# Altium schematic sheet ADC.SchDoc: ThunderScope 1000E
size A4; DrawnBy: Aleksa Bjelogrlic; Revision: 1; SheetNumber: 5; SheetTotal: 14
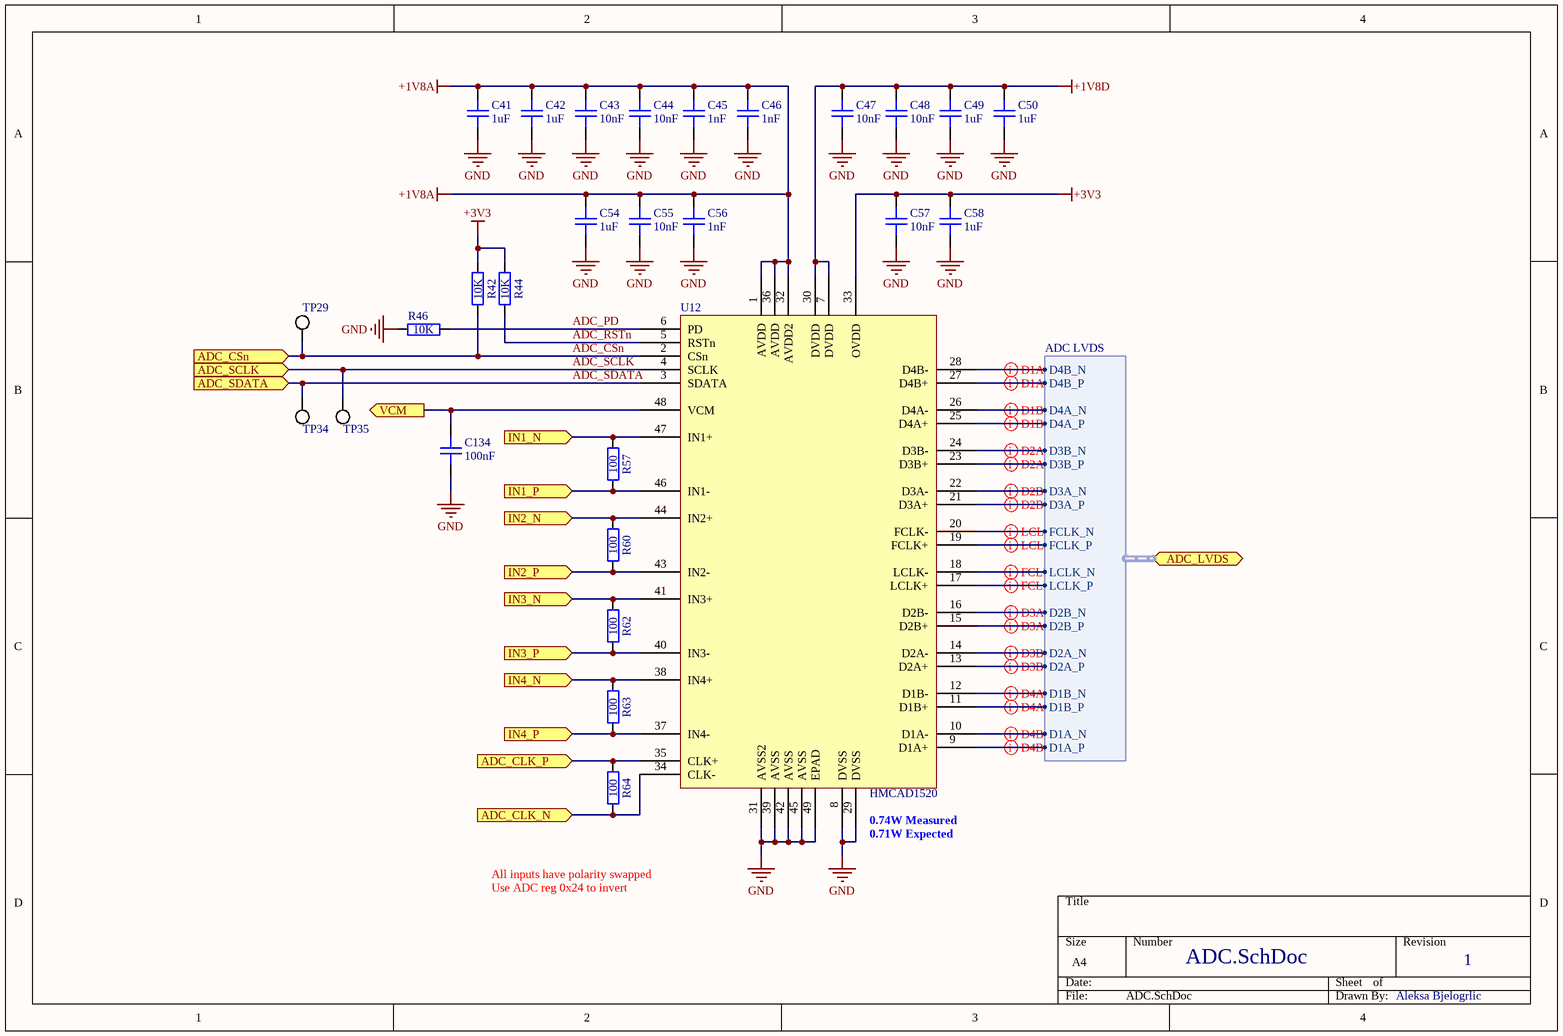
[diagram p0: ADC.SchDoc]

## Parts
C41  1uF  [GEN_C_0402]
C42  1uF  [GEN_C_0402]
C43  10nF  [GEN_C_0402]
C44  10nF  [GEN_C_0402]
C45  1nF  [GEN_C_0402]
C46  1nF  [GEN_C_0402]
C47  10nF  [GEN_C_0402]
C48  10nF  [GEN_C_0402]
C49  1uF  [GEN_C_0402]
C50  1uF  [GEN_C_0402]
C54  1uF  [GEN_C_0402]
C55  10nF  [GEN_C_0402]
C56  1nF  [GEN_C_0402]
C57  10nF  [GEN_C_0402]
C58  1uF  [GEN_C_0402]
C134  100nF  [GEN_C_0402]
R42  10K  [GEN_R_0402]
R44  10K  [GEN_R_0402]
R46  10K  [GEN_R_0402]
R57  100  [GEN_R_0402]
R60  100  [GEN_R_0402]
R62  100  [GEN_R_0402]
R63  100  [GEN_R_0402]
R64  100  [GEN_R_0402]
TP29  PCB  [GEN_TP_PCB]  (value not drawn)  (no BOM)
TP34  PCB  [GEN_TP_PCB]  (value not drawn)  (no BOM)
TP35  PCB  [GEN_TP_PCB]  (value not drawn)  (no BOM)
U12  HMCAD1520  [AD_QFN48_LP7]

## Ports
ADC_CLK_N (in), ADC_CLK_P (in), ADC_CSn (in), ADC_LVDS (bidir, harness ADC LVDS), ADC_SCLK (in), ADC_SDATA (in), IN1_N (in), IN1_P (in), IN2_N (in), IN2_P (in), IN3_N (in), IN3_P (in), IN4_N (in), IN4_P (in), VCM (out)

## Harnesses
ADC LVDS: D4B_N, D4B_P, D4A_N, D4A_P, D3B_N, D3B_P, D3A_N, D3A_P, FCLK_N, FCLK_P, LCLK_N, LCLK_P, D2B_N, D2B_P, D2A_N, D2A_P, D1B_N, D1B_P, D1A_N, D1A_P

## Nets
+1V8A: C41.2 C42.2 C43.2 C44.2 C45.2 C46.2 C54.2 C55.2 C56.2 U12.1(AVDD) U12.32(AVDD2) U12.36(AVDD)
+1V8D: C47.2 C48.2 C49.2 C50.2 U12.7(DVDD) U12.30(DVDD)
+3V3: C57.2 C58.2 R42.2 R44.2 U12.33(OVDD)
GND: C41.1 C42.1 C43.1 C44.1 C45.1 C46.1 C47.1 C48.1 C49.1 C50.1 C54.1 C55.1 C56.1 C57.1 C58.1 C134.1 R46.2 U12.8(DVSS) U12.29(DVSS) U12.31(AVSS2) U12.39(AVSS) U12.42(AVSS) U12.45(AVSS) U12.49(EPAD)
ADC_CLK_N: R64.1 U12.34(CLK-) ; port ADC_CLK_N
ADC_CLK_P: R64.2 U12.35(CLK+) ; port ADC_CLK_P
ADC_CSn: R42.1 TP29.1 U12.2(CSn) ; port ADC_CSn
ADC_PD: R46.1 U12.6(PD)
ADC_RSTn: R44.1 U12.5(RSTn)
ADC_SCLK: TP35.1 U12.4(SCLK) ; port ADC_SCLK
ADC_SDATA: TP34.1 U12.3(SDATA) ; port ADC_SDATA
IN1_N: R57.2 U12.47(IN1+) ; port IN1_N
IN1_P: R57.1 U12.46(IN1-) ; port IN1_P
IN2_N: R60.2 U12.44(IN2+) ; port IN2_N
IN2_P: R60.1 U12.43(IN2-) ; port IN2_P
IN3_N: R62.2 U12.41(IN3+) ; port IN3_N
IN3_P: R62.1 U12.40(IN3-) ; port IN3_P
IN4_N: R63.2 U12.38(IN4+) ; port IN4_N
IN4_P: R63.1 U12.37(IN4-) ; port IN4_P
VCM: C134.2 U12.48(VCM) ; port VCM
NetU12_9: U12.9(D1A+) ; port ADC_LVDS.D1A_P
NetU12_10: U12.10(D1A-) ; port ADC_LVDS.D1A_N
NetU12_11: U12.11(D1B+) ; port ADC_LVDS.D1B_P
NetU12_12: U12.12(D1B-) ; port ADC_LVDS.D1B_N
NetU12_13: U12.13(D2A+) ; port ADC_LVDS.D2A_P
NetU12_14: U12.14(D2A-) ; port ADC_LVDS.D2A_N
NetU12_15: U12.15(D2B+) ; port ADC_LVDS.D2B_P
NetU12_16: U12.16(D2B-) ; port ADC_LVDS.D2B_N
NetU12_17: U12.17(LCLK+) ; port ADC_LVDS.LCLK_P
NetU12_18: U12.18(LCLK-) ; port ADC_LVDS.LCLK_N
NetU12_19: U12.19(FCLK+) ; port ADC_LVDS.FCLK_P
NetU12_20: U12.20(FCLK-) ; port ADC_LVDS.FCLK_N
NetU12_21: U12.21(D3A+) ; port ADC_LVDS.D3A_P
NetU12_22: U12.22(D3A-) ; port ADC_LVDS.D3A_N
NetU12_23: U12.23(D3B+) ; port ADC_LVDS.D3B_P
NetU12_24: U12.24(D3B-) ; port ADC_LVDS.D3B_N
NetU12_25: U12.25(D4A+) ; port ADC_LVDS.D4A_P
NetU12_26: U12.26(D4A-) ; port ADC_LVDS.D4A_N
NetU12_27: U12.27(D4B+) ; port ADC_LVDS.D4B_P
NetU12_28: U12.28(D4B-) ; port ADC_LVDS.D4B_N

## Layout directives
differential pair: NetU12_9, NetU12_10, NetU12_11, NetU12_12, NetU12_13, NetU12_14, NetU12_15, NetU12_16, NetU12_17, NetU12_18, NetU12_19, NetU12_20, NetU12_21, NetU12_22, NetU12_23, NetU12_24, NetU12_25, NetU12_26, NetU12_27, NetU12_28

## Notes on the sheet
- (near U12) 0.74W Measured
- (near U12) 0.71W Expected
- All inputs have polarity swapped
- Use ADC reg 0x24 to invert
- Aleksa Bjelogrlic

## Library data of the parts
C41 C42 C49 C50 C54 C58 = CAP 1uF 25V X5R 0402: Manufacturer: Murata; Manufacturer Part Number: GRM155R61E105KA12D; Voltage Rating: 25V; Package: 0402; Supplier 1: Mouser; Supplier Part Number 1: 81-GRM155R61E105KA2D; Value: 1uF
C43 C44 C47 C48 C55 C57 = CAP 10nF 50V X7R 0402: House Part Number: C-10nF-0402-002; Manufacturer: Murata; Manufacturer Part Number: GRM155R71H103KA88J; Voltage Rating: 50V; Package: 0402; Supplier 1: Mouser; Supplier Part Number 1: 81-GRM155R71H103KA8J; Value: 10nF
C45 C46 C56 = CAP 1nF 50V C0G 0402: Manufacturer: Murata; Manufacturer Part Number: GRM1555C1H102FA01D; Voltage Rating: 50V; Package: 0402; Supplier 1: Mouser; Supplier Part Number 1: 81-GRM1555C1H102FA1D; Value: 1nF
C134 = CAP 100nF 16V X7R 0402: House Part Number: C-100nF-0402-002; Manufacturer: Murata; Manufacturer Part Number: GCM155R71C104KA55D; Voltage Rating: 16V; Package: 0402; Supplier 1: Mouser; Supplier Part Number 1: 81-GCM155R71C104KA5D; Value: 100nF
R42 R44 R46 = RES 10K OHM 1% 1/10W 0402: Manufacturer: Panasonic; Manufacturer Part Number: ERJ-2RKF1002X; Tolerance: 1%; Package: 0402; Supplier 1: Mouser; Supplier Part Number 1: 667-ERJ-2RKF1002X; Value: 10K
R57 R60 R62-R64 = RES 100 OHM 1% 1/10W 0402: Manufacturer: Yageo; Manufacturer Part Number: RC0402FR-07100RL; Tolerance: 1%; Package: 0402; Value: 100; Supplier 1: Mouser; Supplier Part Number 1: 603-RC0402FR-07100RL
TP29 TP34 TP35 = TP PCB 1mm
U12 = IC ADC HMCAD1520: Manufacturer: Analog Devices; Supplier 1: Mouser; Supplier Part Number 1: 584-HMCAD1520; Manufacturer Part Number: HMCAD1520